# Altium schematic sheet MicroController_AHRS.SchDoc: MicroController_AHRS.SchDoc
size A4; CheckedBy: fx; Author: flotox@yeah.net; Revision: v1.0.0; SheetNumber: 8; SheetTotal: 10
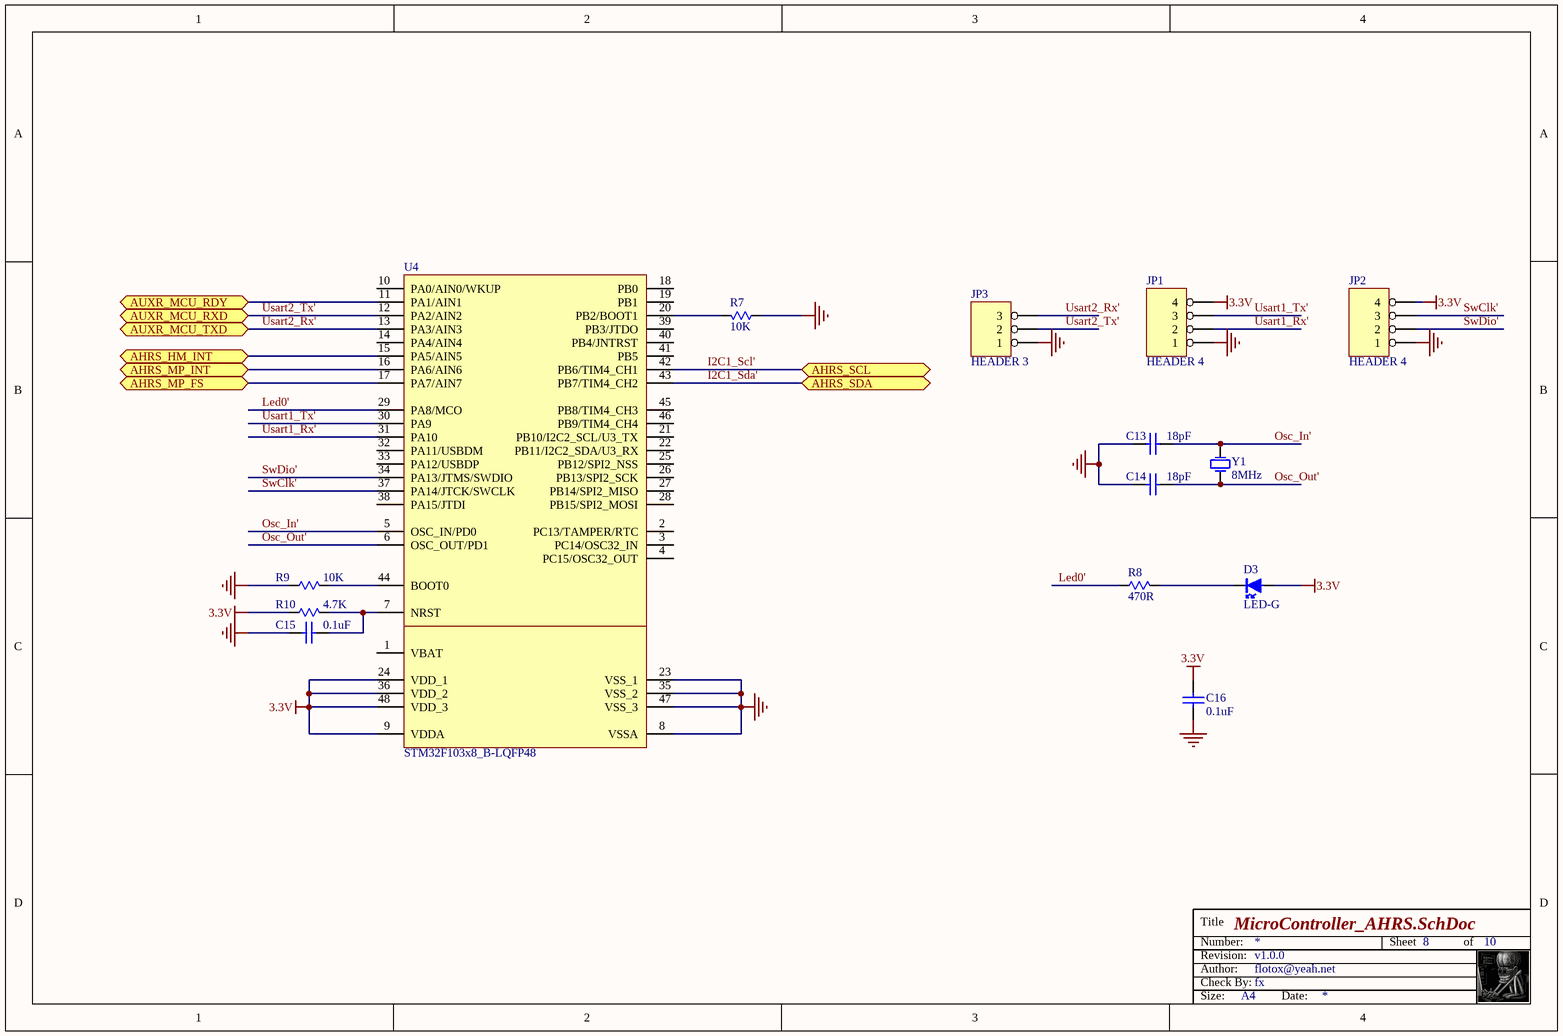
[diagram p0: MicroController_AHRS.SchDoc]

## Parts
C13  18pF  [C0603-S]
C14  18pF  [C0603-S]
C15  0.1uF  [C0603-S]
C16  0.1uF  [C0603-S]
D3  LED-G  [LED0603]
JP1  HEADER 4  [SPOX-4P]
JP2  HEADER 4  [HDR1X4]
JP3  HEADER 3  [HDR1X3]
R7  10K  [R0603-S]
R8  470R  [R0603-S]
R9  10K  [R0603-S]
R10  4.7K  [R0603-S]
U4  STM32F103x8_B-LQFP48  [LQFP7x7-48]
Y1  8MHz  [XTAL-49SMD]

## Ports
AHRS_HM_INT, AHRS_MP_FS, AHRS_MP_INT, AHRS_SCL, AHRS_SDA, AUXR_MCU_RDY, AUXR_MCU_RXD, AUXR_MCU_TXD

## Nets
3.3V: C16.2 D3.1(A) JP1.4 JP2.4 R10.2 U4.9(VDDA) U4.24(VDD_1) U4.36(VDD_2) U4.48(VDD_3)
GND: C13.2 C14.2 C15.2 C16.1 JP1.1 JP2.1 JP3.1 R7.2 R9.2 U4.8(VSSA) U4.23(VSS_1) U4.35(VSS_2) U4.47(VSS_3)
AHRS_HM_INT: U4.15(PA5/AIN5) ; port AHRS_HM_INT
AHRS_MP_FS: U4.17(PA7/AIN7) ; port AHRS_MP_FS
AHRS_MP_INT: U4.16(PA6/AIN6) ; port AHRS_MP_INT
AUXR_MCU_RDY: U4.11(PA1/AIN1) ; port AUXR_MCU_RDY
I2C1_Scl': U4.42(PB6/TIM4_CH1) ; port AHRS_SCL
I2C1_Sda': U4.43(PB7/TIM4_CH2) ; port AHRS_SDA
Led0': R8.2 U4.29(PA8/MCO)
Osc_In': C13.1 U4.5(OSC_IN/PD0) Y1.1(OSC1)
Osc_Out': C14.1 U4.6(OSC_OUT/PD1) Y1.2(OSC2)
SwClk': JP2.3 U4.37(PA14/JTCK/SWCLK)
SwDio': JP2.2 U4.34(PA13/JTMS/SWDIO)
Usart1_Rx': JP1.2 U4.31(PA10)
Usart1_Tx': JP1.3 U4.30(PA9)
Usart2_Rx': JP3.3 U4.13(PA3/AIN3) ; port AUXR_MCU_TXD
Usart2_Tx': JP3.2 U4.12(PA2/AIN2) ; port AUXR_MCU_RXD
NetC15_1: C15.1 R10.1 U4.7(NRST)
NetD3_2: D3.2(K) R8.1
NetR7_1: R7.1 U4.20(PB2/BOOT1)
NetR9_1: R9.1 U4.44(BOOT0)

Not connected (* = marked no-connect by the designer): U4 1(VBAT) 2(PC13/TAMPER/RTC) 3(PC14/OSC32_IN) 4(PC15/OSC32_OUT) 10(PA0/AIN0/WKUP) 14(PA4/AIN4) 18(PB0) 19(PB1) 21(PB10/I2C2_SCL/U3_TX) 22(PB11/I2C2_SDA/U3_RX) 25(PB12/SPI2_NSS) 26(PB13/SPI2_SCK) 27(PB14/SPI2_MISO) 28(PB15/SPI2_MOSI) 32(PA11/USBDM) 33(PA12/USBDP) 38(PA15/JTDI) 39(PB3/JTDO) 40(PB4/JNTRST) 41(PB5) 45(PB8/TIM4_CH3) 46(PB9/TIM4_CH4)

## Notes on the sheet
- Title
- Revision:
- Number:
- Author:
- Check By:
- Sheet
- of
- Size:
- A4
- Date:

## Library data of the parts
C13-C16 = CAP: Capacitor
D3 = LED: Light Emitting Diode
R7-R10 = RES: Resistor
U4 = STM32F103x8_B-LQFP48: Medium-density performance line ARM-based 32-bit MCU with 64 or 128 KB Flash, USB, CAN, 7 timers, 2 ADCs, 9 communication interfaces
Y1 = XTAL-CRYSTALS: Crystals